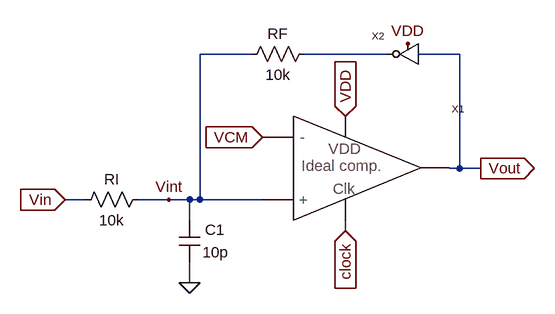
[diagram p0: schematic 1_bit_1st_PNS_mod_MSD.asc]
1_bit_1st_PNS_mod_MSD.asc, the LTspice schematic file:
Version 4
SHEET 1 880 680
WIRE -48 -64 -128 -64
WIRE 160 -64 32 -64
WIRE 272 -64 208 -64
WIRE 272 112 272 -64
WIRE 272 112 256 112
WIRE 304 112 272 112
WIRE -304 160 -336 160
WIRE -176 160 -224 160
WIRE -144 160 -176 160
WIRE -128 160 -128 -64
WIRE -128 160 -144 160
WIRE -32 160 -128 160
WIRE -144 192 -144 160
WIRE 96 208 96 192
WIRE -144 288 -144 256
FLAG 96 32 VDD
IOPIN 96 32 In
FLAG 96 208 clock
IOPIN 96 208 In
FLAG 304 112 Vout
IOPIN 304 112 Out
FLAG -144 288 0
FLAG -336 160 Vin
IOPIN -336 160 In
FLAG -176 160 Vint
FLAG -32 64 VCM
IOPIN -32 64 In
FLAG 192 -80 VDD
SYMBOL Ideal_clocked_comparator 16 112 R0
SYMATTR InstName X1
SYMBOL cap -160 192 R0
WINDOW 0 40 14 Left 0
WINDOW 3 36 49 Left 0
SYMATTR InstName C1
SYMATTR Value 10p
SYMBOL res -208 144 R90
WINDOW 0 0 56 VBottom 0
WINDOW 3 32 56 VTop 0
SYMATTR InstName RI
SYMATTR Value 10k
SYMBOL res 48 -80 R90
WINDOW 0 0 56 VBottom 0
WINDOW 3 32 56 VTop 0
SYMATTR InstName RF
SYMATTR Value 10k
SYMBOL inverter 208 -64 M0
SYMATTR InstName X2

The netlist it stands for:
* 1_bit_1st_PNS_mod_MSD.asc
XX1 VCM Vint Vout VDD clock Ideal_clocked_comparator  ; pins Vinm Vinp Vout VDD Clock
C1 Vint 0 10p
RI Vint Vin 10k
RF N001 Vint 10k
XX2 Vout N001 VDD inverter  ; pins In Out VDD
.backanno
.end